# EAGLE schematic os31_master (EAGLE 7.7.0)
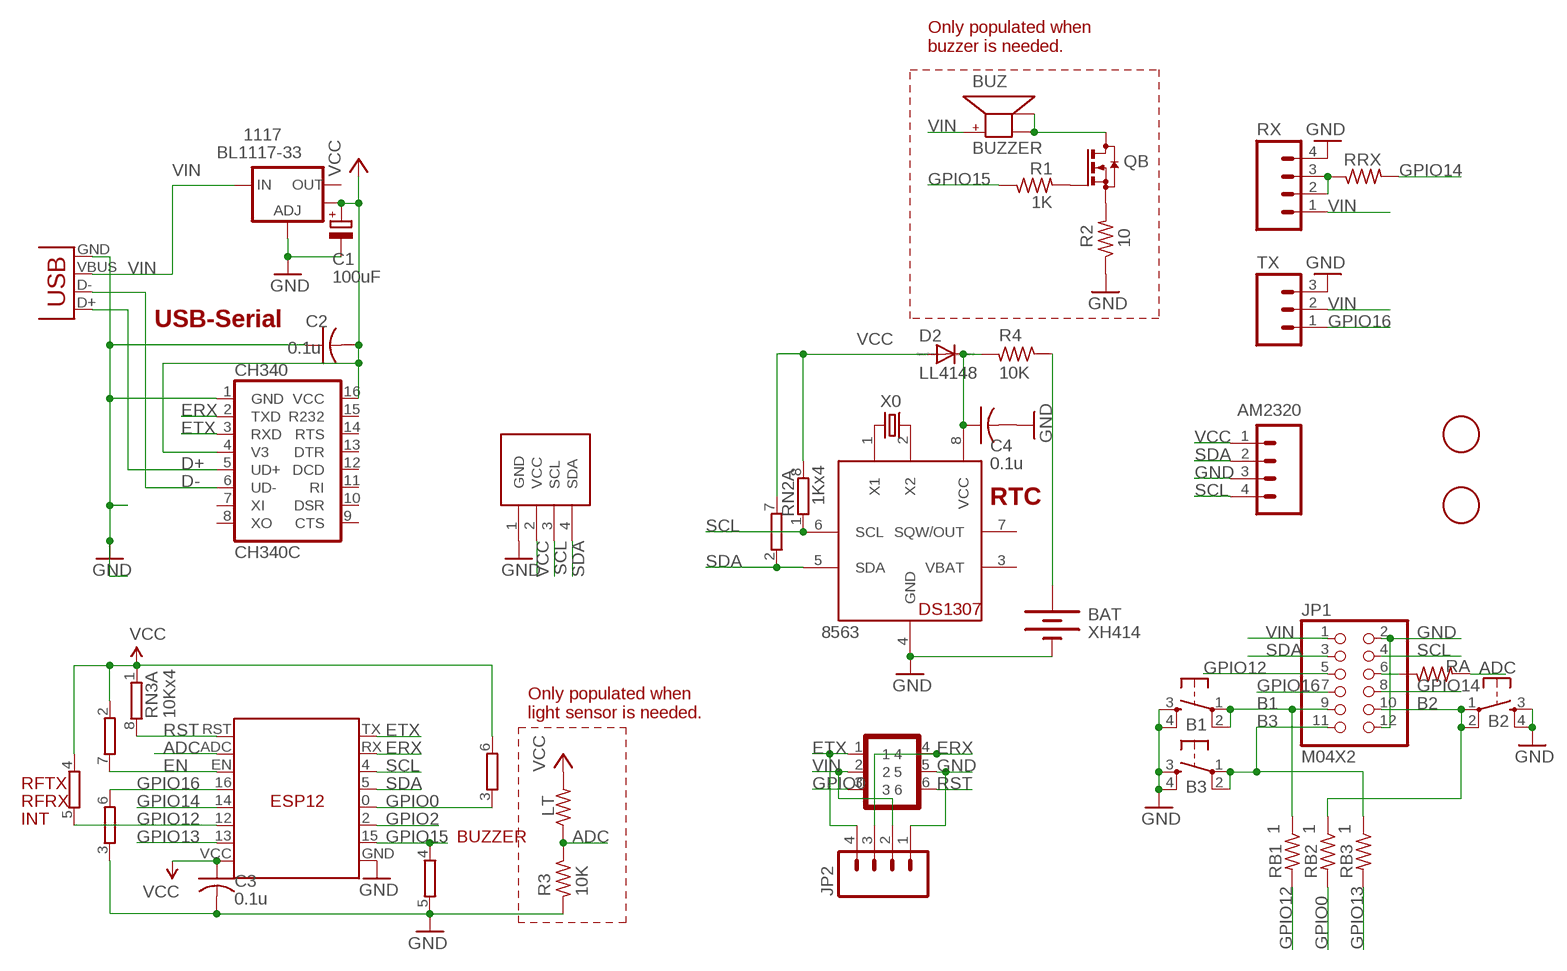
[diagram p0: schematic, sheet 1]

## Parts
1F  FIDUCIAL  [FIDUCIAL_1MM]
2F  FIDUCIAL  [FIDUCIAL_1MM]
1117  BL1117-33  V_REG_LM1117SOT223  [SOT223]
8563  PCF8563  DS1307SOIC  [SO08]
AM2320  M04NARROW  [1X04-NARROW]
B1  SPST_TACTEVQQ2  [EVQ-Q2]
B2  SPST_TACTEVQQ2  [EVQ-Q2]
B3  SPST_TACTEVQQ2  [EVQ-Q2]
BAT  XH414  BATTERYXH414  [BATTCON_XH414]
BUZ  BUZZER  [SMT-8585-BUZZER]
C1  100uF  CPOL-EUCT3528  [CT3528]
C2  0.1u  C-USC0603  [C0603]
C3  0.1u  C-USC0603  [C0603]
C4  0.1u  C-USC0603  [C0603]
CH340  CH340C  CH340G  [SO16]
D2  LL4148  DIODE-SOD123  [SOD123]
ESP  ESP-12N  ESP12ESPWES  [ESP12_WES]
JP1  M04X2  PINHD-2X6  [2X06]
JP2  M04PTH  [1X04]
LCD  SSD1306_OLED_I2CSMD3  [SSD1306_OLED_I2C_SMD3]
LT  100K  R-US_R1206  [R1206]
QB  MMBT3904  BSS123  [SOT23]
R1  1K  R-US_R0603  [R0603]
R2  10  R-US_R0603  [R0603]
R3  10K  R-US_R0603  [R0603]
R4  10K  R-US_R0603  [R0603]
RA  1  R-US_R0603  [R0603]
RB1  1  R-US_R0603  [R0603]
RB2  1  R-US_R0603  [R0603]
RB3  1  R-US_R0603  [R0603]
RN2  1Kx4  4R-NEXB38V  [EXB38V]
RN3  10Kx4  4R-NEXB38V  [EXB38V]
RRX  1K  R-US_R0603  [R0603]
RX  M04LOCK  [1X04_LOCK]
TX  M03LOCK  [1X03_LOCK]
U$3  GOLDFINGER_2X3  [GOLDFINGER_2X3]
USB  USBMICROB2  [USB-MICROB2]
X0  32.768kHz  CRYSTALMM20SS1  [MM20SS1]

## Nets
ADC: ESP.ADC LT.1 R3.1 RA.2
B1: B1.1 B1.2 JP1.9 RB1.1
B2: B2.1 B2.2 JP1.10 RB2.1
B3: B3.1 B3.2 JP1.11 RB3.1
D+: CH340.5(UD+) USB.D+
D-: CH340.6(UD-) USB.D-
EN: ESP.EN RN3.7
ERX: CH340.2(TXD) ESP.RX JP2.3 U$3.4
ETX: CH340.3(RXD) ESP.TX JP2.4 U$3.1
GND [power]: 1117.1(ADJ) 8563.4(GND) AM2320.3 B1.3 B1.4 B2.3 B2.4 B3.3 B3.4 BAT.P$1(-) C1.+(-) C2.1 C3.2 C4.2 CH340.1(GND) ESP.GND JP1.2 JP1.12 JP2.1 LCD.1(GND) R2.1 R3.2 RN2.5 RN3.3 RX.4 TX.3 U$3.5 USB.GND
GPIO0: ESP.0(G0) RB2.2 RN2.3 U$3.3
GPIO2: ESP.2(G2)
GPIO12: ESP.12(G12) JP1.5 RB1.2 RN3.5
GPIO13: ESP.13(G13) RB3.2
GPIO14: ESP.14(G14) JP1.8 RRX.2
GPIO15: ESP.15(G15) R1.1 RN2.4
GPIO16: ESP.16(G16) JP1.7 RN3.6 TX.1
N$1: 8563.1(X1) X0.1
N$2: BUZ.- BUZ.A- QB.3(D)
N$7: QB.1(G) R1.2
N$8: QB.2(S) R2.2
N$9 [adc]: JP1.6 RA.1
N$11: 8563.8(VCC) C4.1 D2.C R4.2
N$26: RRX.1 RX.2 RX.3
N$30: 8563.2(X2) X0.4
N$36: BAT.P$2(+) R4.1
RST: ESP.RST RN3.8 U$3.6
SCL: 8563.6(SCL) AM2320.4 ESP.4(G4) JP1.4 LCD.3(SCL) RN2.1
SDA: 8563.5(SDA) AM2320.2 ESP.5(G5) JP1.3 LCD.4(SDA) RN2.2
VCC: 1117.4(OUT) AM2320.1 C1.-(+) C2.2 C3.1 CH340.4(V3) CH340.16(VCC) D2.A ESP.VCC LCD.2(VCC) LT.2 RN2.6 RN2.7 RN2.8 RN3.1 RN3.2 RN3.4
VIN: 1117.3(IN) BUZ.+ JP1.1 JP2.2 RX.1 TX.2 U$3.2 USB.VBUS
Unconnected: 1117.2(OUT) 8563.7(SQW/OUT) CH340.7(XI) CH340.8(XO) CH340.9(CTS) CH340.10(DSR) CH340.11(RI) CH340.12(DCD) CH340.13(DTR) CH340.14(RTS) CH340.15(R232)

## Notes on the sheet
- Only populated when
  buzzer is needed.
- USB-Serial
- RTC
- Only populated when
  light sensor is needed.
- RFTX
- RFRX
- INT
- BUZZER

## Power pins joined to a net without a drawn wire
VBAT: 8563.3(VBAT)

## Library data of the parts
1F 2F = adafruitGood:FIDUCIAL: For use by pick and place machines to calibrate the vision/machine, 1mm By microbuilder.eu
1117 = SparkFun:V_REG_LM1117: Voltage Regulator LM1117 Standard adjustable voltage regulator but in SMD form. Spark Fun Electronics SKU : COM-00595
8563 = adafruit:DS1307: DS1307 Real time clock (RTC) with battery backup ability. Talk to it via i2c
AM2320 RX = SparkFun:M04: Header 4 Standard 4-pin 0.1" header. Use with straight break away headers (SKU : PRT-00116), right angle break away headers (PRT-00553), swiss pins (PRT-00743), machine pins (PRT-00117), and female headers (PRT-00115). Molex polarized connector foot print use with SKU : PRT-08231 with associated ...
B1-B3 = adafruit_3:SPST_TACT: SMT 6mm switch, EVQQ2 series http://www.ladyada.net/library/eagle
BAT = SparkFunNew:BATTERY: Battery Holders Various common sizes : AA, AAA, 20mm coin cell and 12mm coin cell.
BUZ = adafruit:BUZZER
C1 = resistor:CPOL-EU: POLARIZED CAPACITOR, European symbol
C2-C4 = adafruit:C-US: CAPACITOR, American symbol
CH340 = SparkFunNew:CH340
D2 = diode:DIODE-: DIODE
ESP = JeeParts:ESP12
JP1 = pinhead:PINHD-2X6: PIN HEADER
JP2 = SparkFunNew:M04: Header 4 Standard 4-pin 0.1" header. Use with straight break away headers (SKU : PRT-00116), right angle break away headers (PRT-00553), swiss pins (PRT-00743), machine pins (PRT-00117), and female headers (PRT-00115). Molex polarized connector foot print use with SKU : PRT-08231 with associated ...
LCD = adafruit2013:SSD1306_OLED_I2C
LT RB1-RB3 = adafruit2013:R-US_: RESISTOR, American symbol
QB = transistor-small-signal:BSS123: N-CHANNEL MOS FET
R1-R4 RA RRX = adafruitGood:R-US_: RESISTOR, American symbol
RN2 RN3 = resistor-dil:4R-N: Array Chip Resistor Source: RS Component / Phycomp; OC_FARNELL: unknown; OC_NEWARK: unknown
TX = SparkFun:M03: Header 3 Standard 3-pin 0.1" header. Use with straight break away headers (SKU : PRT-00116), right angle break away headers (PRT-00553), swiss pins (PRT-00743), machine pins (PRT-00117), and female headers (PRT-00115). Molex polarized connector foot print use with SKU : PRT-08232 with associated crimp pins and housings.
U$3 = SparkFunNew:GOLDFINGER_2X3
USB = SparkFunNew:USB: USB Connectors USB-B-PTH is fully proven SKU : PRT-00139 USB-miniB is fully proven SKU : PRT-00587 USB-A-PCB is untested. USB-A-H is throughly reviewed, but untested. Spark Fun Electronics SKU : PRT-00437 USB-B-SMT is throughly reviewed, but untested. Needs silkscreen touching up. USB-A-S has not been used/tested USB-MB-H has not been used/tested
X0 = crystal:CRYSTAL: CRYSTAL

## Net classes
0 default: width 0.203 mm, clearance 0.178 mm
1 power: width 0.203 mm, clearance 0.178 mm
2 relaypower: width 0.203 mm, clearance 0.178 mm
3 signal: width 0.203 mm, clearance 0.178 mm
4 adc: width 0.406 mm, clearance 0.178 mm